# EasyEDA Pro project Keithley 2000 SCAN Panasonic V1.0.epro

# Schematic Keithley 2000 SCAN Panasonic V1.0
Board Name: Keithley 2000 SCAN Panasonic V1.0; Create Date: 2026-03-20; Page Name: Main; Project Name: SCAN2000; Schematic Name: Keithley 2000 SCAN Panasonic V1.0; Update Date: 2026-03-21; Company: EasyEDA.com; Page Size: A4; Version: V1.0
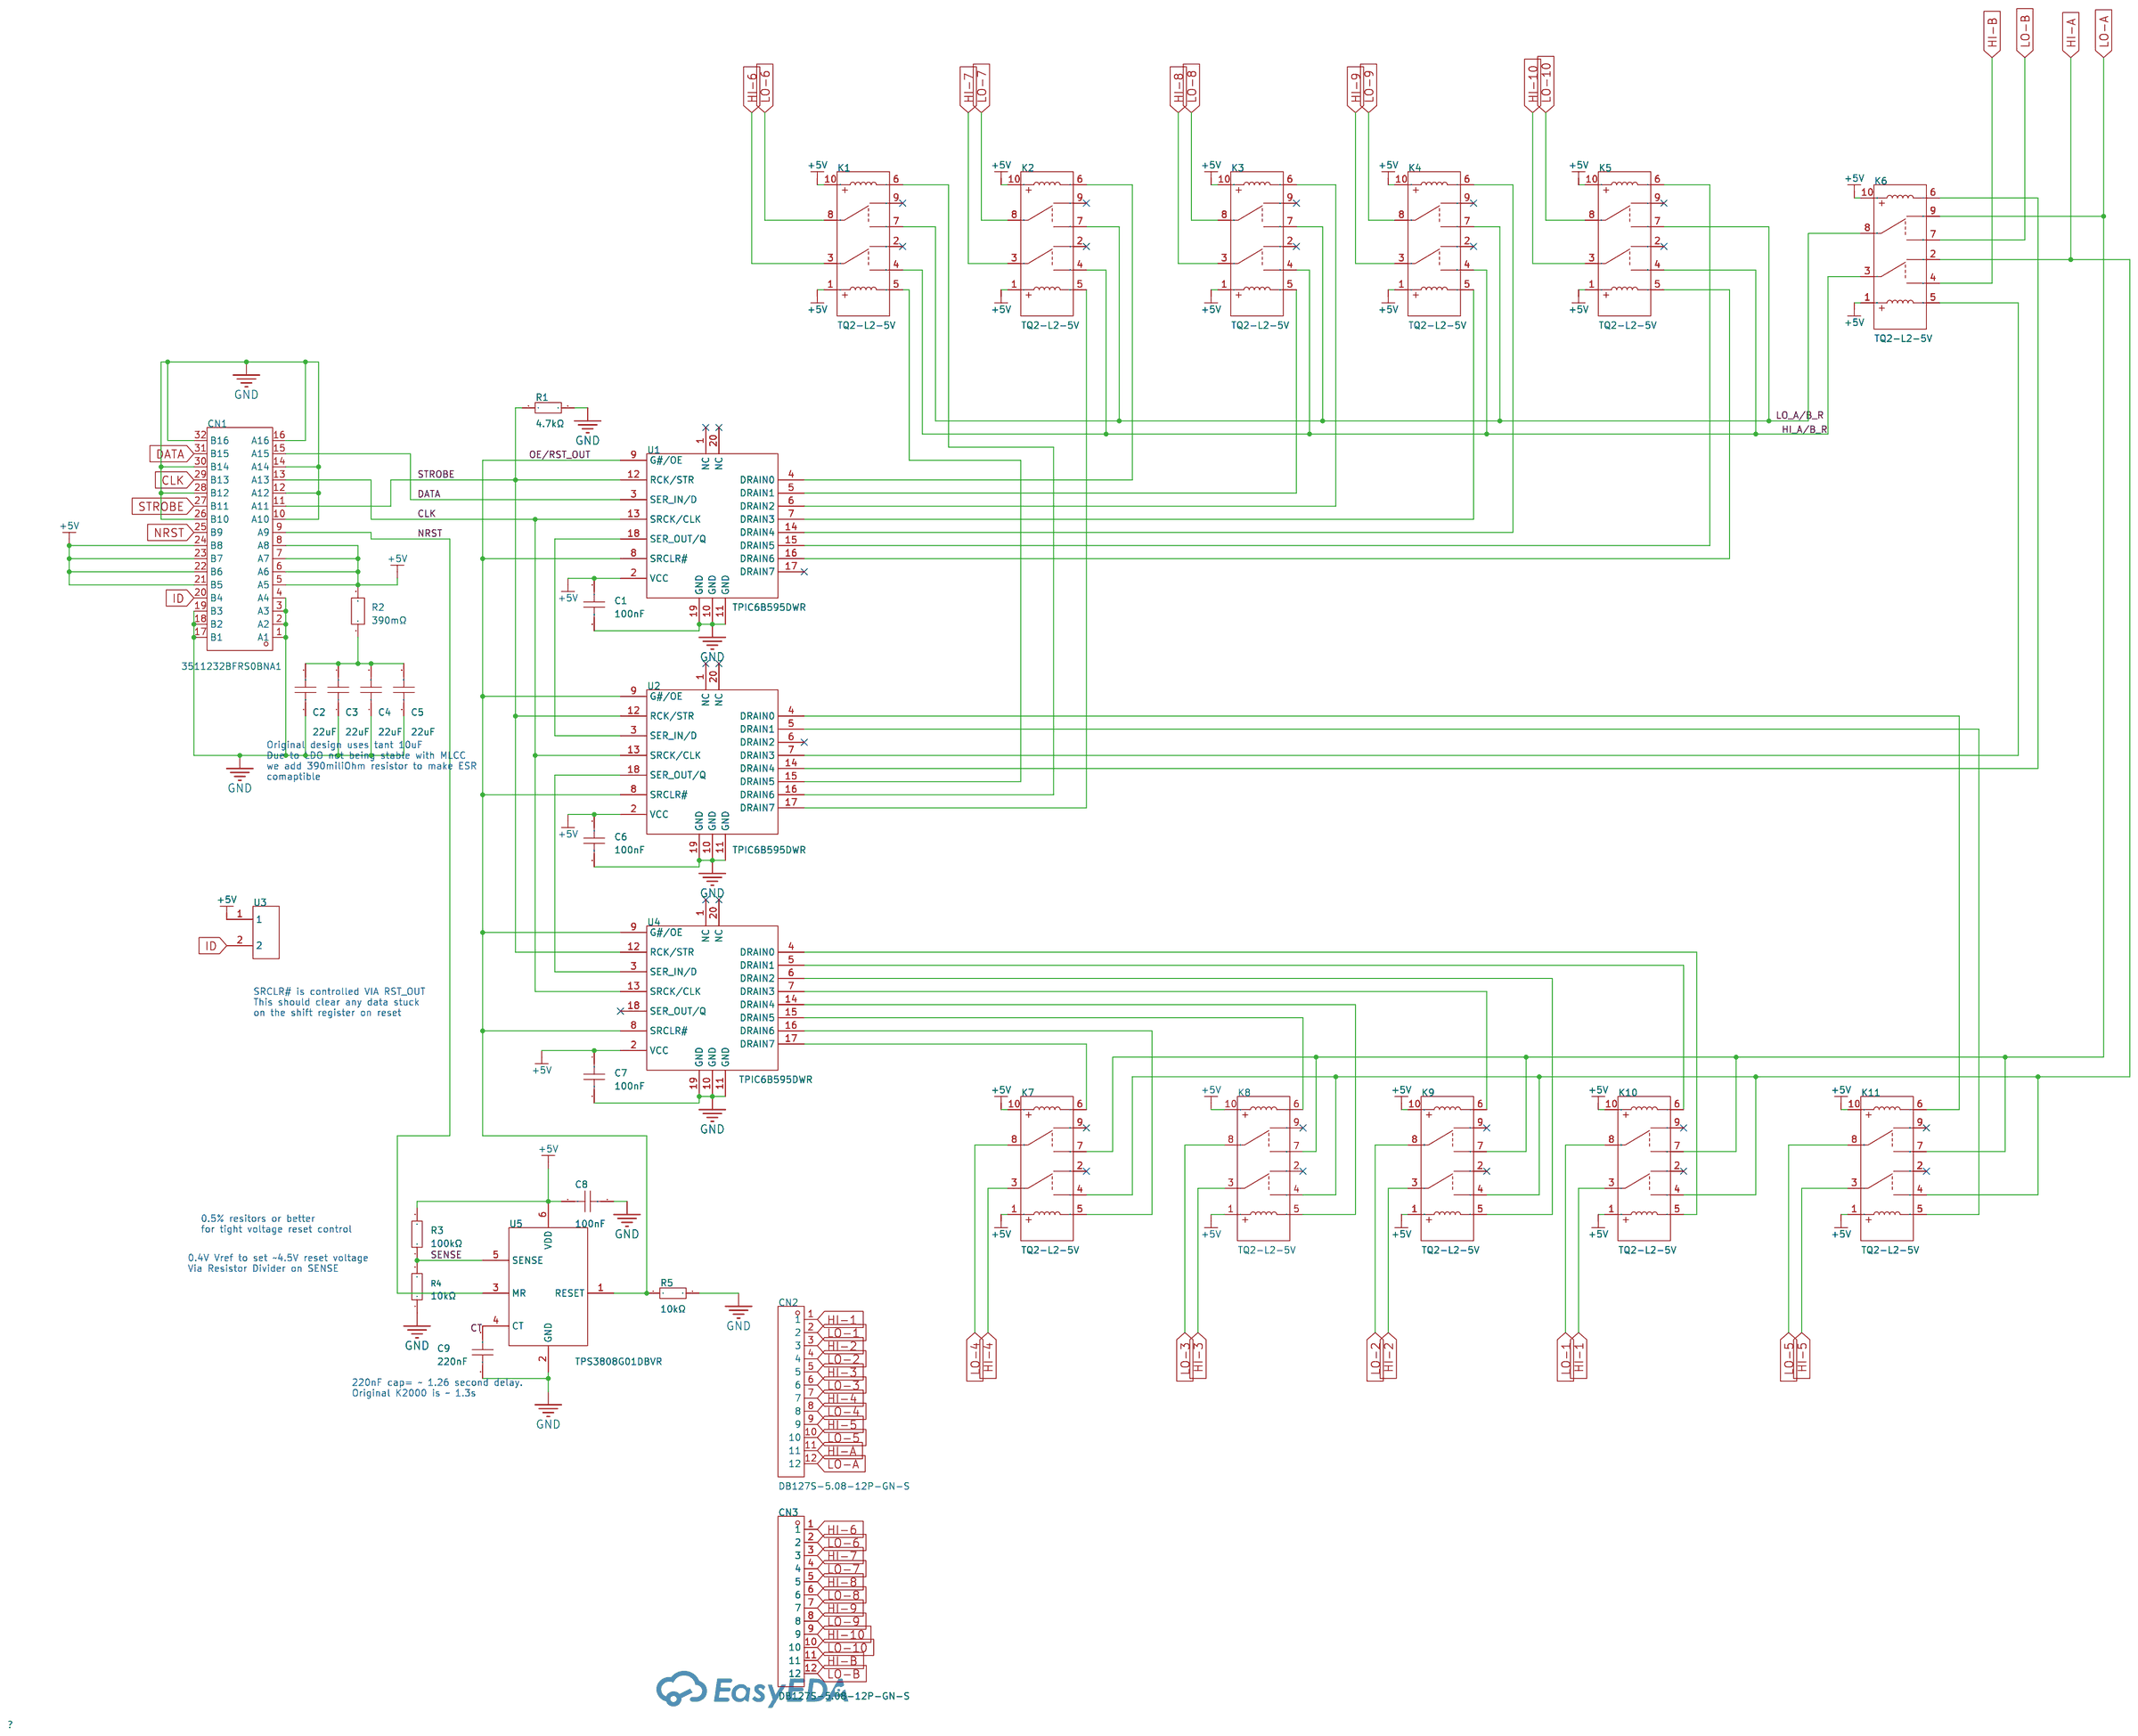
[diagram p0: schematic sheet]

## Parts
C1  100nF  [C0603]
C2  22uF  [C0805]
C3  22uF  [C0805]
C4  22uF  [C0805]
C5  22uF  [C0805]
C6  100nF  [C0603]
C7  100nF  [C0603]
C8  100nF  [C0603]
C9  220nF  [C0603]
CN1  3511232BFRS0BNA1  [CONN-TH_3511232BFRS0BNA1]
CN2  DB127S-5.08-12P-GN-S  [CONN-TH_12P-P5.08_DB127S-5.08-12P-GN-S]
CN3  DB127S-5.08-12P-GN-S  [CONN-TH_12P-P5.08_DB127S-5.08-12P-GN-S]
K1  TQ2-L2-5V  [RELAY-TH_TQ2-L2-XXV]
K2  TQ2-L2-5V  [RELAY-TH_TQ2-L2-XXV]
K3  TQ2-L2-5V  [RELAY-TH_TQ2-L2-XXV]
K4  TQ2-L2-5V  [RELAY-TH_TQ2-L2-XXV]
K5  TQ2-L2-5V  [RELAY-TH_TQ2-L2-XXV]
K6  TQ2-L2-5V  [RELAY-TH_TQ2-L2-XXV]
K7  TQ2-L2-5V  [RELAY-TH_TQ2-L2-XXV]
K8  TQ2-L2-5V  [RELAY-TH_TQ2-L2-XXV]
K9  TQ2-L2-5V  [RELAY-TH_TQ2-L2-XXV]
K10  TQ2-L2-5V  [RELAY-TH_TQ2-L2-XXV]
K11  TQ2-L2-5V  [RELAY-TH_TQ2-L2-XXV]
R1  4.7kΩ  [R0603]
R2  390mΩ  [R1206]
R3  100kΩ  [R0603]
R4  10kΩ  [R0603]
R5  10kΩ  [R0603]
U1  TPIC6B595DWR  [SOIC-20_L13.0-W7.6-P1.27-LS10.3-BL]
U2  TPIC6B595DWR  [SOIC-20_L13.0-W7.6-P1.27-LS10.3-BL]
U3  -  [Solder Jumper New]
U4  TPIC6B595DWR  [SOIC-20_L13.0-W7.6-P1.27-LS10.3-BL]
U5  TPS3808G01DBVR  [SOT-23-6_L2.9-W1.6-P0.95-LS2.8-BR]

## Library data of the parts
C1 C6-C8 = CL10B104KB8NNNC: Capacitance:100nF Tolerance:±10% Tolerance:±10% Voltage Rating:50V Temperature Coefficient:X7R; LCSC Part Name: 100nF ±10% 50V; Supplier Part: C1591; Manufacturer: SAMSUNG(三星); Supplier Footprint: 0603; JLCPCB Part Class: Extended Part; Datasheet: https://item.szlcsc.com/datasheet/CL10B104KB8NNNC/1943.html; Supplier: LCSC; Tolerance: ±10%; Voltage Rating: 50V; Temperature Coefficient: X7R
C2-C5 = CL21A226MAYNNNE: Capacitance:22uF Tolerance:±20% Tolerance:±20% Voltage Rating:25V Temperature Coefficient:X5R; LCSC Part Name: 22uF ±20% 25V; Supplier Part: C602037; Manufacturer: SAMSUNG(三星); Supplier Footprint: 0805; Datasheet: https://item.szlcsc.com/datasheet/CL21A226MAYNNNE/631473.html; Supplier: LCSC; Tolerance: ±20%; Voltage Rating: 25V; Temperature Coefficient: X5R
C9 = CL10B224KA8NNNC: Capacitance:220nF Tolerance:±10% Tolerance:±10% Voltage Rating:25V Temperature Coefficient:X7R; LCSC Part Name: 220nF ±10% 25V; Supplier Part: C21120; Manufacturer: SAMSUNG(三星); Supplier Footprint: 0603; JLCPCB Part Class: Basic Part; Datasheet: https://item.szlcsc.com/datasheet/CL10B224KA8NNNC/21832.html; Supplier: LCSC; Tolerance: ±10%; Voltage Rating: 25V; Temperature Coefficient: X7R
CN1 = 3511232BFRS0BNA1: Number of Pins:32P Pitch:2.54mm Mounting Type:Right Angle Number of Rows:2 Current Rating:3A Contact Material:Brass Contact Plating:Gold Operating Temperature:-40℃~+105℃ Operating Temperature:-40℃~+105℃; LCSC Part Name: PIN:32P 间距:2.54mm 弯插; Supplier Part: C963692; Manufacturer: JILN(锦凌); Supplier Footprint: 弯插,P=2.54mm; Datasheet: https://item.szlcsc.com/datasheet/3511232BFRS0BNA1/1048125.html; Supplier: LCSC; Number of Pins: 32P; Pitch: 2.54mm; Mounting Type: Right Angle; Number of Rows: 2; Current Rating: 3A; Contact Material: Brass; Contact Plating: Gold; Operating Temperature: -40℃~+105℃
CN2 CN3 = DB127S-5.08-12P-GN-S: Number of Positions or Pins:1x12P Pitch:5.08mm Color:Green Mounting Type:Through Hole Number of Pins:12P Number of Rows:1 Number of PINs Per Row:12 Screw Specification:M3 Current Rating:12A Voltage Rating (Max):300V Wire Gauge - AWG:14~26 Wire Gauge - mm2; LCSC Part Name: 1x12P 5.08mm 直插 排数:1 每排P数:12; Supplier Part: C18198311; Manufacturer: DORABO(地博电气); Supplier Footprint: 插件,P=5.08mm; JLCPCB Part Class: Extended Part; Datasheet: https://item.szlcsc.com/datasheet/DB127S-5.08-12P-GN-S/19349685.html; Supplier: LCSC; Number of Positions or Pins: 1x12P; Pitch: 5.08mm; Color: Green; Mounting Type: Through Hole; Number of Pins: 12P; Number of Rows: 1; Number of PINs Per Row: 12; Screw Specification: M3; Current Rating: 12A; Voltage Rating (Max): 300V; Wire Gauge - AWG: 14~26; Wire Gauge - mm2: 1.5; Operating Temperature: -40℃~+105℃
K1-K11 = TQ2-L2-5V: Coil Voltage:5V Contact Form:2 Form C: 2C (DPDT-CO) Number of Pins:- Contact Rating:- Switching Voltage(Max):125V@AC；110V@DC Coil Type:Dual Coil Contact Material:Silver + Gold Plated Coil Rated Power:- Coil Resistance:- Switching Current(Max):1A Operate T; Supplier Part: C1525303; Manufacturer: PANASONIC(松下); Supplier Footprint: DIP,14x9mm; JLCPCB Part Class: Extended Part; Datasheet: https://item.szlcsc.com/datasheet/TQ2-L2-5V/1616102.html; Supplier: LCSC; Coil Voltage: 5V; Contact Form: 2 Form C: 2C (DPDT-CO); Switching Voltage(Max): 125V@AC；110V@DC; Coil Type: Dual Coil; Contact Material: Silver + Gold Plated; Switching Current(Max): 1A; Operate Time: 3ms; Release Time: 3ms; Operating Temperature: -40℃~+70℃
R1 = RC0603FR-074K7L: Type:Thick Film Resistor Resistance:4.7kΩ Tolerance:±1% Tolerance:±1% Power(Watts):100mW Voltage-Supply(Max):75V Temperature Coefficient:±100ppm/℃ Temperature Coefficient:±100ppm/℃ Operating Temperature:-55℃~+155℃ Operating Temperature:-55℃~+155℃; LCSC Part Name: 厚膜电阻 4.7kΩ ±1% 100mW; Supplier Part: C99782; Manufacturer: YAGEO(国巨); Supplier Footprint: 0603; JLCPCB Part Class: Extended Part; Datasheet: https://item.szlcsc.com/datasheet/RC0603FR-074K7L/100996.html; Supplier: LCSC; Type: Thick Film Resistor; Tolerance: ±1%; Power(Watts): 100mW; Voltage-Supply(Max): 75V; Temperature Coefficient: ±100ppm/℃; Operating Temperature: -55℃~+155℃
R2 = FRL1206FR390TS: Type:Thick Film Resistor Resistance:390mΩ Tolerance:±1% Tolerance:±1% Power(Watts):250mW Voltage-Supply(Max):500V Temperature Coefficient:±300ppm/℃ Temperature Coefficient:±300ppm/℃ Operating Temperature:-55℃~+155℃ Operating Temperature:-55℃~+155℃; LCSC Part Name: 390mΩ ±1% 250mW 厚膜电阻; Supplier Part: C2907353; Manufacturer: FOJAN(富捷); Supplier Footprint: 1206; JLCPCB Part Class: Extended Part; Datasheet: https://item.szlcsc.com/datasheet/FRL1206FR390TS/3180866.html; Supplier: LCSC; Type: Thick Film Resistor; Tolerance: ±1%; Power(Watts): 250mW; Voltage-Supply(Max): 500V; Temperature Coefficient: ±300ppm/℃; Operating Temperature: -55℃~+155℃
R3 = AR03DTCX1003: Type:Thin Film Resistor Resistance:100kΩ Tolerance:±0.5% Tolerance:±0.5% Power(Watts):100mW Voltage-Supply(Max):75V Temperature Coefficient:±25ppm/℃ Temperature Coefficient:±25ppm/℃ Operating Temperature:-55℃~+155℃ Operating Temperature:-55℃~+155℃; LCSC Part Name: 薄膜电阻 100kΩ ±0.5% 100mW; Supplier Part: C319967; Manufacturer: Viking(光颉); Supplier Footprint: 0603; Datasheet: https://item.szlcsc.com/datasheet/AR03DTCX1003/301037.html; Supplier: LCSC; Type: Thin Film Resistor; Tolerance: ±0.5%; Power(Watts): 100mW; Voltage-Supply(Max): 75V; Temperature Coefficient: ±25ppm/℃; Operating Temperature: -55℃~+155℃
R4 = 0603WAD1002T5E: Type:Thick Film Resistor Resistance:10kΩ Tolerance:±0.5% Tolerance:±0.5% Power(Watts):100mW Voltage-Supply(Max):75V Temperature Coefficient:±100ppm/℃ Temperature Coefficient:±100ppm/℃ Operating Temperature:-55℃~+155℃ Operating Temperature:-55℃~+155℃; LCSC Part Name: 10kΩ ±0.5% 100mW 厚膜电阻; Supplier Part: C167144; Manufacturer: UNI-ROYAL(厚声); Supplier Footprint: 0603; JLCPCB Part Class: Extended Part; Datasheet: https://item.szlcsc.com/datasheet/0603WAD1002T5E/178527.html; Supplier: LCSC; Type: Thick Film Resistor; Tolerance: ±0.5%; Power(Watts): 100mW; Voltage-Supply(Max): 75V; Temperature Coefficient: ±100ppm/℃; Operating Temperature: -55℃~+155℃
R5 = RC0603FR-0710KL: Type:Thick Film Resistors Resistance: Tolerance:±1% Tolerance:±1% Power(Watts): Overload Voltage (Max): Temperature Coefficient:±100ppm/℃ Temperature Coefficient:±100ppm/℃ Operating Temperature Range:-55℃~+155℃ Operating Temperature Range:-55℃~+155℃; LCSC Part Name: 厚膜电阻 10kΩ ±1% 100mW; Supplier Part: C98220; Manufacturer: YAGEO(国巨); Supplier Footprint: 0603; JLCPCB Part Class: Extended Part; Datasheet: https://atta.szlcsc.com/upload/public/pdf/source/20180927/C295883_E8D83085EA81BD7DE0B2B681138C15EE.pdf; Supplier: LCSC; Type: Thick Film Resistors; Tolerance: ±1%; Temperature Coefficient: ±100ppm/℃; Operating Temperature Range: -55℃~+155℃
U1 U2 U4 = TPIC6B595DWR: Function:Serial-to-Serial or Parallel Voltage - Supply:4.5V~5.5V Voltage - Supply:4.5V~5.5V Clock Frequency:- Number of Elements:1 Number of Bits per Element:- Output Type:Open Drain Series:TPIC Operating Temperature:-40℃~+125℃ Operating Temperature:-40℃~; LCSC Part Name: 开路漏极输出 8位串行至串行或并行移位寄存器; Supplier Part: C7094; Manufacturer: TI(德州仪器); Supplier Footprint: SOIC-20-300mil; JLCPCB Part Class: Extended Part; Datasheet: https://www.ti.com/cn/lit/gpn/tpic6b595; Supplier: LCSC; Function: Serial-to-Serial or Parallel; Voltage - Supply: 4.5V~5.5V; Number of Elements: 1; Output Type: Open Drain; Series: TPIC; Operating Temperature: -40℃~+125℃
U3 = Solder Jumper New
U5 = TPS3808G01DBVR: ChipType:Voltage monitor Output Type:Open Drain Voltage - Supply:1.7V~6.5V Voltage - Supply:1.7V~6.5V Reset Active Level:Active Low Threshold Voltage:405mV Number of Voltages Monitored:1 Manual Reset:Yes Watchdog:No Reset Timeout:20us Operating Temperatur; LCSC Part Name: 低静态电流可编程延迟监控电路; Supplier Part: C19653; Manufacturer: TI(德州仪器); Supplier Footprint: SOT-23-6; JLCPCB Part Class: Extended Part; Datasheet: https://www.ti.com/cn/lit/gpn/tps3808; Supplier: LCSC; ChipType: Voltage monitor; Output Type: Open Drain; Voltage - Supply: 1.7V~6.5V; Reset Active Level: Active Low; Threshold Voltage: 405mV; Number of Voltages Monitored: 1; Manual Reset: Yes; Watchdog: No; Reset Timeout: 20us; Operating Temperature: -40℃~+125℃@(Tj)

## Nets
+5V: C1.1 C6.1 C7.1 C8.2 CN1.5(A5) CN1.6(A6) CN1.7(A7) CN1.8(A8) CN1.21(B5) CN1.22(B6) CN1.23(B7) CN1.24(B8) K1.1 K1.10(6) K2.1 K2.10(6) K3.1 K3.10(6) K4.1 K4.10(6) K5.1 K5.10(6) K6.1 K6.10(6) K7.1 K7.10(6) K8.1 K8.10(6) K9.1 K9.10(6) K10.1 K10.10(6) K11.1 K11.10(6) R2.2 R3.2 U1.2(VCC) U2.2(VCC) U3.1 U4.2(VCC) U5.6(VDD)
GND: C1.2 C2.1 C3.1 C4.1 C5.1 C6.2 C7.2 C8.1 C9.2 CN1.1(A1) CN1.2(A2) CN1.3(A3) CN1.4(A4) CN1.10(A10) CN1.12(A12) CN1.14(A14) CN1.16(A16) CN1.17(B1) CN1.18(B2) CN1.19(B3) CN1.26(B10) CN1.28(B12) CN1.30(B14) CN1.32(B16) R1.2 R4.1 R5.2 U1.10(GND) U1.11(GND) U1.19(GND) U2.10(GND) U2.11(GND) U2.19(GND) U4.10(GND) U4.11(GND) U4.19(GND) U5.2(GND)
CLK: CN1.13(A13) CN1.29(B13) U1.13(SRCK/CLK) U2.13(SRCK/CLK) U4.13(SRCK/CLK)
CT: C9.1 U5.4(CT)
DATA: CN1.15(A15) CN1.31(B15) U1.3(SER IN/D)
HI-1: CN2.1 K10.3(4)
HI-2: CN2.3 K9.3(4)
HI-3: CN2.5 K8.3(4)
HI-4: CN2.7 K7.3(4)
HI-5: CN2.9 K11.3(4)
HI-6: CN3.1 K1.3(4)
HI-7: CN3.3 K2.3(4)
HI-8: CN3.5 K3.3(4)
HI-9: CN3.7 K4.3(4)
HI-10: CN3.9 K5.3(4)
HI-A: CN2.11 K6.2(3) K7.4(5) K8.4(5) K9.4(5) K10.4(5) K11.4(5)
HI-B: CN3.11 K6.4(5)
HI_A/B_R: K1.4(5) K2.4(5) K3.4(5) K4.4(5) K5.4(5) K6.3(4)
ID: CN1.20(B4) U3.2
LO-1: CN2.2 K10.8(9)
LO-2: CN2.4 K9.8(9)
LO-3: CN2.6 K8.8(9)
LO-4: CN2.8 K7.8(9)
LO-5: CN2.10 K11.8(9)
LO-6: CN3.2 K1.8(9)
LO-7: CN3.4 K2.8(9)
LO-8: CN3.6 K3.8(9)
LO-9: CN3.8 K4.8(9)
LO-10: CN3.10 K5.8(9)
LO-A: CN2.12 K6.9(10) K7.7(8) K8.7(8) K9.7(8) K10.7(8) K11.7(8)
LO-B: CN3.12 K6.7(8)
LO_A/B_R: K1.7(8) K2.7(8) K3.7(8) K4.7(8) K5.7(8) K6.8(9)
NRST: CN1.9(A9) CN1.25(B9) U5.3(MR)
OE/RST_OUT: R5.1 U1.8(SRCLR#) U1.9(G#/OE) U2.8(SRCLR#) U2.9(G#/OE) U4.8(SRCLR#) U4.9(G#/OE) U5.1(RESET)
SENSE: R3.1 R4.2 U5.5(SENSE)
STROBE: CN1.11(A11) CN1.27(B11) R1.1 U1.12(RCK/STR) U2.12(RCK/STR) U4.12(RCK/STR)
$K1_5: K1.5(12) U2.15(DRAIN5)
$K1_6: K1.6(7) U2.16(DRAIN6)
$K2_5: K2.5(12) U2.17(DRAIN7)
$K2_6: K2.6(7) U1.4(DRAIN0)
$K3_5: K3.5(12) U1.5(DRAIN1)
$K3_6: K3.6(7) U1.6(DRAIN2)
$K4_5: K4.5(12) U1.7(DRAIN3)
$K4_6: K4.6(7) U1.14(DRAIN4)
$K5_5: K5.5(12) U1.16(DRAIN6)
$K5_6: K5.6(7) U1.15(DRAIN5)
$K6_5: K6.5(12) U2.7(DRAIN3)
$K6_6: K6.6(7) U2.14(DRAIN4)
$K11_5: K11.5(12) U2.5(DRAIN1)
$K11_6: K11.6(7) U2.4(DRAIN0)
$U1_18: U1.18(SER OUT/Q) U2.3(SER IN/D)
Net-(C2-2): C2.2 C3.2 C4.2 C5.2 R2.1
Net-(K7-5): K7.5(12) U4.16(DRAIN6)
Net-(K7-6): K7.6(7) U4.17(DRAIN7)
Net-(K8-5): K8.5(12) U4.14(DRAIN4)
Net-(K8-6): K8.6(7) U4.15(DRAIN5)
Net-(K9-5): K9.5(12) U4.6(DRAIN2)
Net-(K9-6): K9.6(7) U4.7(DRAIN3)
Net-(K10-5): K10.5(12) U4.4(DRAIN0)
Net-(K10-6): K10.6(7) U4.5(DRAIN1)
Net-(U2-18): U2.18(SER OUT/Q) U4.3(SER IN/D)

Not connected (* = marked no-connect by the designer): K1 2(3)* 9(10)*; K2 2(3)* 9(10)*; K3 2(3)* 9(10)*; K4 2(3)* 9(10)*; K5 2(3)* 9(10)*; K7 2(3)* 9(10)*; K8 2(3)* 9(10)*; K9 2(3)* 9(10)*; K10 2(3)* 9(10)*; K11 2(3)* 9(10)*; U1 1(NC)* 17(DRAIN7)* 20(NC)*; U2 1(NC)* 6(DRAIN2)* 20(NC)*; U4 1(NC)* 18(SER OUT/Q)* 20(NC)*

## Notes on the sheet
- Original design uses tant 10uF
  Due to LDO not being stable with MLCC
  we add 390miliOhm resistor to make ESR
  comaptible
- SRCLR# is controlled VIA RST_OUT
  This should clear any data stuck
  on the shift register on reset
- 0.5% resitors or better
  for tight voltage reset control
- 0.4V Vref to set ~4.5V reset voltage
  Via Resistor Divider on SENSE
- 220nF cap= ~ 1.26 second delay.
  Original K2000 is ~ 1.3s

# Board Keithley 2000 SCAN Panasonic V1.0
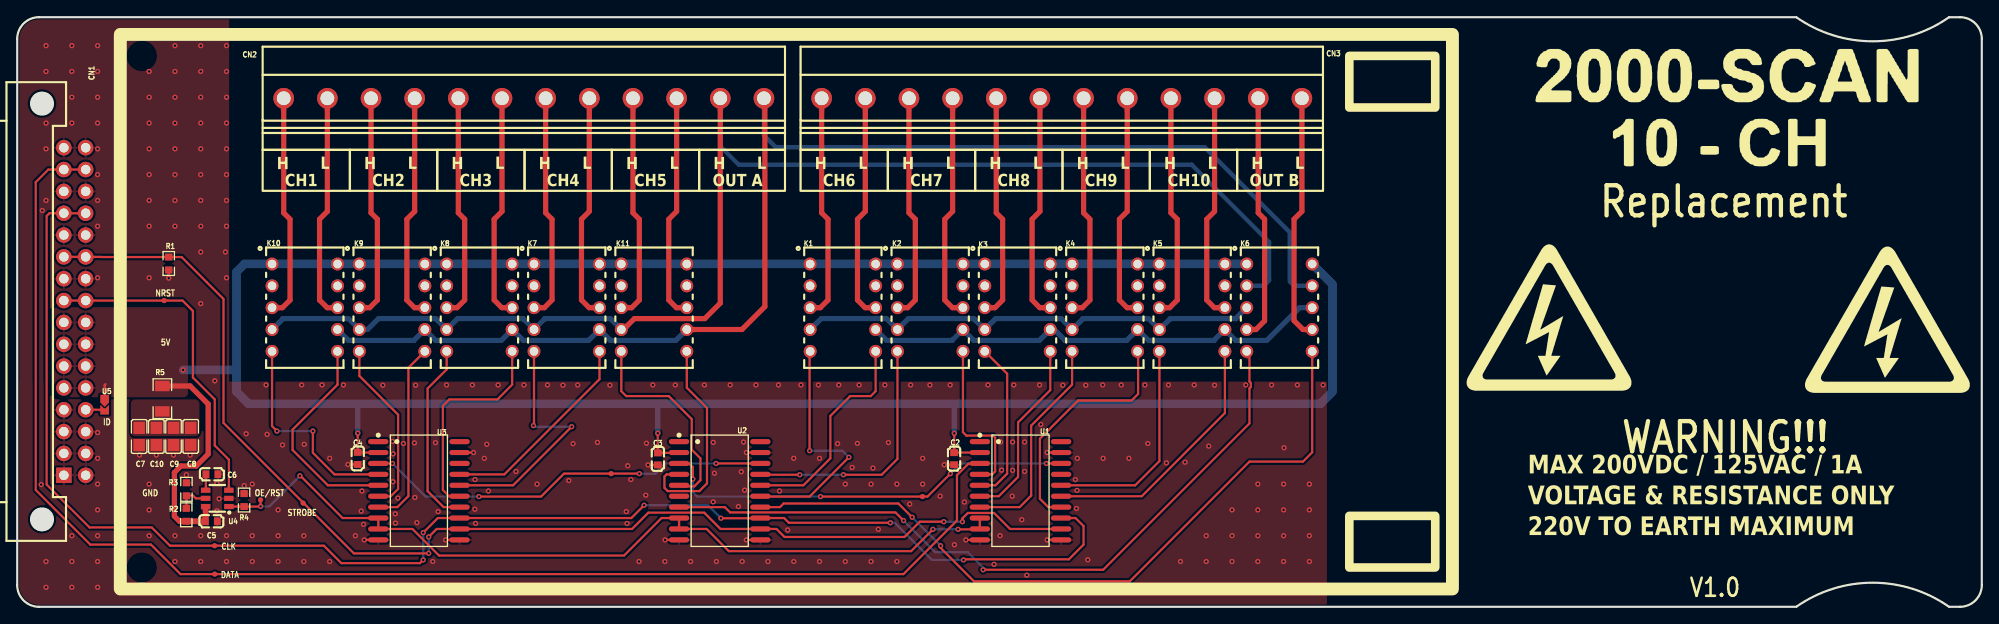
[diagram p1: board, top side]
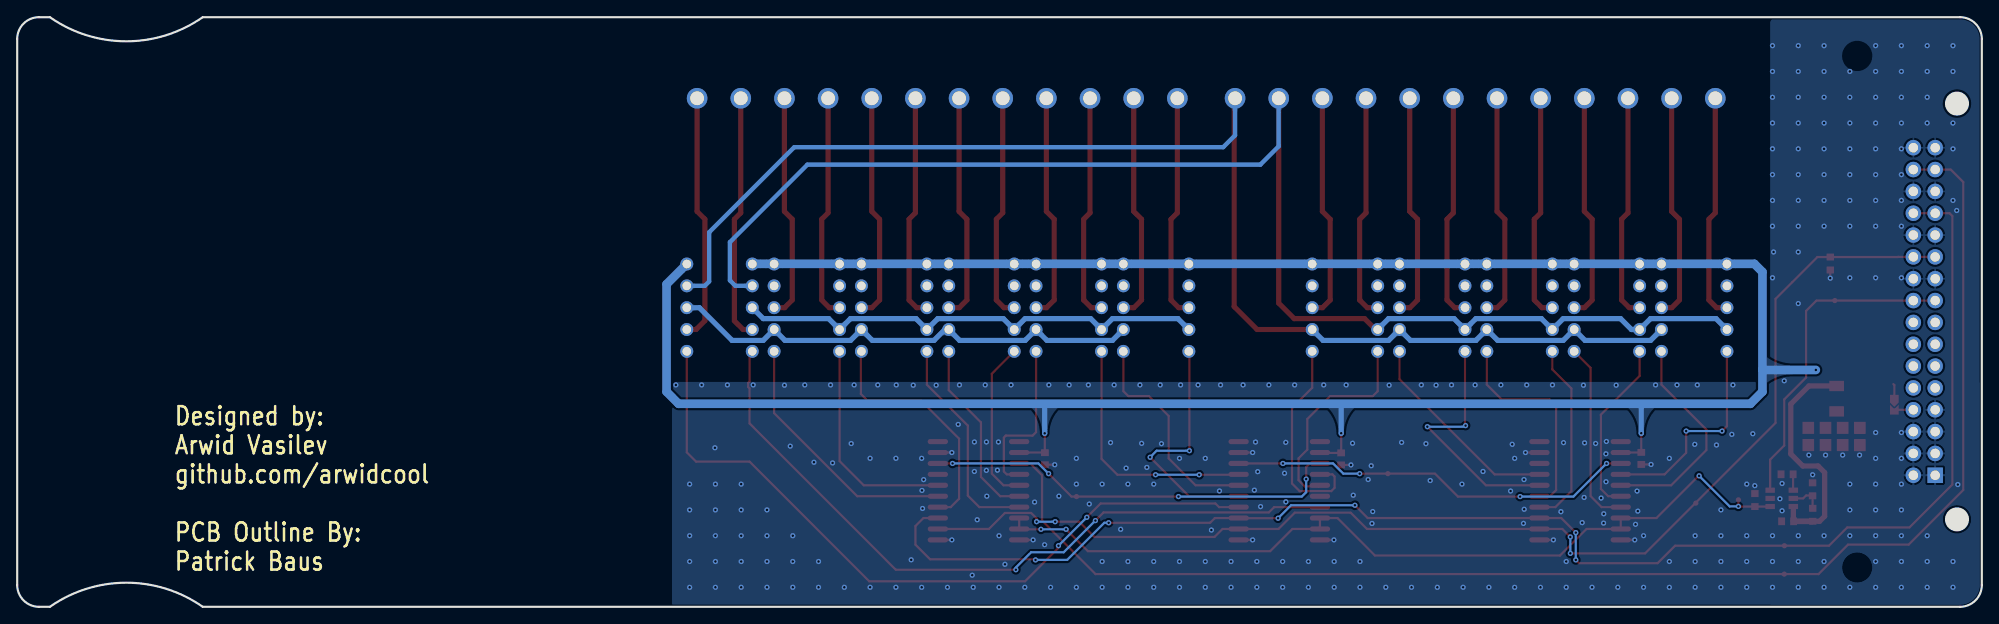
[diagram p2: board, bottom side, seen from below]

Outline 228.6 x 68.58 mm; copper layers: Top Layer, Bottom Layer. Coordinates in mm from the lower left corner of the outline.
Outline path: 0,66.04 arc(0.74,67.84) 2.54,68.58 207.01,68.58 arc(215.9,65.78) 224.79,68.58 226.06,68.58 arc(227.86,67.84) 228.6,66.04 228.6,2.54 arc(227.86,0.74) 226.06,0 224.79,0 arc(215.9,2.8) 207.01,0 2.54,0 arc(0.74,0.74) 0,2.54 0,66.04
Stack: Top Layer 0.035mm / Dielectric1 1.51mm FR4 er 4.5 / Bottom Layer 0.035mm

## Design rules (mm)
template: JLCPCB Capability(Two Layers Board)
spacing copperThickness1oz (default): track to track 0.102, other pairs 0.152 to 0.3
spacing copperThickness2oz: track to track 0.203, other pairs 0.152 to 0.3
track width copperThickness1oz (default): min 0.127, default 0.254, max 2.54
track width copperThickness2oz: min 0.203, default 0.254, max 2.54
differential pair differentialPair (default): width min 0.127, default 0.254, max 2.54; gap min 0.152, default 0.152
via viaSize (default): diameter min 0.5, default 0.61, max 10; hole min 0.3, default 0.305, max 6.3

## Placement (name value [footprint] x y rotation side)
C2  22uF  [C0603]  109.02 17.23 270 top
C3  22uF  [C0603]  74.55 17.2 270 top
C4  22uF  [C0603]  39.62 17.26 270 top
C5  22uF  [C0603]  22.6 9.95 180 top
C6  100nF  [C0603]  22.66 15.42 0 top
C7  100nF  [C0805]  14.19 19.81 90 top
C8  100nF  [C0805]  20.19 19.81 90 top
C9  220nF  [C0805]  18.19 19.81 90 top
C10  22uF  [C0805]  16.19 19.81 90 top
CN1  3511232BFRS0BNA1  [CONN-TH_3511232BFRS0BNA1]  6.7 34.35 270 top
CN2  DB127S-5.08-12P-GN-S  [CONN-TH_12P-P5.08_DB127S-5.08-12P-GN-S]  58.95 59.15 0 top
CN3  DB127S-5.08-12P-GN-S  [CONN-TH_12P-P5.08_DB127S-5.08-12P-GN-S]  121.55 59.15 0 top
K1  TQ2-L2-5V  [RELAY-TH_TQ2-L2-XXV]  96.08 34.79 270 top
K2  TQ2-L2-5V  [RELAY-TH_TQ2-L2-XXV]  106.24 34.79 270 top
K3  TQ2-L2-5V  [RELAY-TH_TQ2-L2-XXV]  116.4 34.79 270 top
K4  TQ2-L2-5V  [RELAY-TH_TQ2-L2-XXV]  126.56 34.79 270 top
K5  TQ2-L2-5V  [RELAY-TH_TQ2-L2-XXV]  136.72 34.79 270 top
K6  TQ2-L2-5V  [RELAY-TH_TQ2-L2-XXV]  146.88 34.79 270 top
K7  TQ2-L2-5V  [RELAY-TH_TQ2-L2-XXV]  63.95 34.79 270 top
K8  TQ2-L2-5V  [RELAY-TH_TQ2-L2-XXV]  53.79 34.79 270 top
K9  TQ2-L2-5V  [RELAY-TH_TQ2-L2-XXV]  43.63 34.79 270 top
K10  TQ2-L2-5V  [RELAY-TH_TQ2-L2-XXV]  33.47 34.79 270 top
K11  TQ2-L2-5V  [RELAY-TH_TQ2-L2-XXV]  74.11 34.79 270 top
NOREF  -  [Pad_e19999]  28.32 12.44 0 top
NOREF#2  -  [Pad_e19981]  17.1 35.62 0 top
NOREF#3  -  [Pad_e20018]  69.11 15.49 0 top
NOREF#4  -  [Pad_e19987]  33.28 12.06 0 top
NOREF#5  -  [Pad_e20005]  22.99 3.8 0 top
NOREF#6  -  [Pad_e2097]  22.97 7.11 0 top
NOREF#7  -  [Pad_e20012]  105.34 12.82 0 top
R1  4.7kΩ  [R0603]  17.63 39.93 270 top
R2  390mΩ  [R0603]  19.67 10.7 270 top
R3  100kΩ  [R0603]  19.69 13.67 270 top
R4  10kΩ  [R0603]  26.4 12.42 90 top
R5  10kΩ  [R1206]  16.89 24.21 90 top
U1  TPIC6B595DWR  [SOIC-20_L13.0-W7.6-P1.27-LS10.3-BL]  116.74 13.5 270 top
U2  TPIC6B595DWR  [SOIC-20_L13.0-W7.6-P1.27-LS10.3-BL]  81.74 13.5 270 top
U3  TPIC6B595DWR  [SOIC-20_L13.0-W7.6-P1.27-LS10.3-BL]  46.74 13.5 270 top
U4  TPIC6B595DWR  [SOT-23-6_L2.9-W1.6-P0.95-LS2.8-BR]  23.28 12.61 0 top
U5  TPS3808G01DBVR  [Solder Jumper New]  10.18 23.25 270 top

## Footprints (pads in the part's own frame, mm; a bottom-side part is the same pattern mirrored in y, then rotated)
C0603
  rect 0.8x0.9 smd: 1(-0.7,0) 2(0.7,0)
C0805
  rect 1.41x1.35 smd: 1(-1,0) 2(1,0)
CONN-TH_12P-P5.08_DB127S-5.08-12P-GN-S
  round 2.4 hole 1.6: 1(-27.94,0) 2(-22.86,0) 3(-17.78,0) 4(-12.7,0) 5(-7.62,0) 6(-2.54,0) 7(2.54,0) 8(7.62,0) 9(12.7,0) 10(17.78,0) 11(22.86,0) 12(27.94,0)
CONN-TH_3511232BFRS0BNA1
  rect 1.8x1.8 hole 1.1: 1(19.05,-1.27)
  round 1.8 hole 1.1: 2(16.51,-1.27) 3(13.97,-1.27) 4(11.43,-1.27) 5(8.89,-1.27) 6(6.35,-1.27) 7(3.81,-1.27) 8(1.27,-1.27) 9(-1.27,-1.27) 10(-3.81,-1.27) 11(-6.35,-1.27) 12(-8.89,-1.27) 13(-11.43,-1.27) 14(-13.97,-1.27) 15(-16.51,-1.27) 16(-19.05,-1.27) 17(19.05,1.27) 18(16.51,1.27) 19(13.97,1.27) 20(11.43,1.27) 21(8.89,1.27) 22(6.35,1.27) 23(3.81,1.27) 24(1.27,1.27) 25(-1.27,1.27) 26(-3.81,1.27) 27(-6.35,1.27) 28(-8.89,1.27) 29(-11.43,1.27) 30(-13.97,1.27) 31(-16.51,1.27) 32(-19.05,1.27)
Pad_e2097
  round 0.61 smd: TP1(0,0)
Pad_e19981
  round 0.61 smd: TP1(0,0)
Pad_e19987
  round 0.61 smd: TP2(0,0)
Pad_e19999
  round 0.61 smd: TP4(0,0)
Pad_e20005
  round 0.61 smd: TP5(0,0)
Pad_e20012
  round 0.61 smd: TP6(0,0)
Pad_e20018
  round 0.61 smd: TP7(0,0)
R0603
  rect 0.806x0.864 smd: 1(-0.753,0) 2(0.753,0)
R1206
  rect 1.208x1.701 smd: 1(-1.479,0) 2(1.479,0)
RELAY-TH_TQ2-L2-XXV
  round 1.5 hole 1: 1(-5.08,-3.81) 2(-2.54,-3.81) 3(0,-3.81) 4(2.54,-3.81) 5(5.08,-3.81) 6(5.08,3.81) 7(2.54,3.81) 8(0,3.81) 9(-2.54,3.81) 10(-5.08,3.81)
SOIC-20_L13.0-W7.6-P1.27-LS10.3-BL
  oval 0.595x2.36 smd: 1(-5.715,-4.73) 2(-4.445,-4.73) 3(-3.175,-4.73) 4(-1.905,-4.73) 5(-0.635,-4.73) 6(0.635,-4.73) 7(1.905,-4.73) 8(3.175,-4.73) 9(4.445,-4.73) 10(5.715,-4.73) 11(5.715,4.73) 12(4.445,4.73) 13(3.175,4.73) 14(1.905,4.73) 15(0.635,4.73) 16(-0.635,4.73) 17(-1.905,4.73) 18(-3.175,4.73) 19(-4.445,4.73) 20(-5.715,4.73)
Solder Jumper New
  custom 1.397x1.016 smd: 1(-0.699,0)
  custom 1.143x1.016 smd: 2(0.318,0)
SOT-23-6_L2.9-W1.6-P0.95-LS2.8-BR
  rect 1.1x0.6 smd: 1(1.35,-0.95) 2(1.35,0) 3(1.35,0.95) 4(-1.35,0.95) 5(-1.35,0) 6(-1.35,-0.95)

## Nets
+5V: C2.1 C3.1 C4.1 C5.2 CN1.5 CN1.6 CN1.7 CN1.8 CN1.21 CN1.22 CN1.23 CN1.24 K1.1 K1.10 K2.1 K2.10 K3.1 K3.10 K4.1 K4.10 K5.1 K5.10 K6.1 K6.10 K7.1 K7.10 K8.1 K8.10 K9.1 K9.10 K10.1 K10.10 K11.1 K11.10 R2.2 R5.2 U1.2 U2.2 U3.2 U4.6 U5.1
GND: C2.2 C3.2 C4.2 C5.1 C6.2 C7.1 C8.1 C9.1 C10.1 CN1.1 CN1.2 CN1.3 CN1.4 CN1.10 CN1.12 CN1.14 CN1.16 CN1.17 CN1.18 CN1.19 CN1.26 CN1.28 CN1.30 CN1.32 R1.2 R3.1 R4.2 U1.10 U1.11 U1.19 U2.10 U2.11 U2.19 U3.10 U3.11 U3.19 U4.2
$C10_2: C7.2 C8.2 C9.2 C10.2 R5.1
$K1_5: K1.5 U2.15
$K1_6: K1.6 U2.16
$K2_5: K2.5 U2.17
$K2_6: K2.6 U1.4
$K3_5: K3.5 U1.5
$K3_6: K3.6 U1.6
$K4_5: K4.5 U1.7
$K4_6: K4.6 U1.14
$K5_5: K5.5 U1.16
$K5_6: K5.6 U1.15
$K6_5: K6.5 U2.7
$K6_6: K6.6 U2.14
$K7_5: K7.5 U3.16
$K7_6: K7.6 U3.17
$K8_5: K8.5 U3.14
$K8_6: K8.6 U3.15
$K9_5: K9.5 U3.6
$K9_6: K9.6 U3.7
$K10_5: K10.5 U3.4
$K10_6: K10.6 U3.5
$K11_5: K11.5 U2.5
$K11_6: K11.6 U2.4
$U1_18: NOREF#7.TP6 U1.18 U2.3
$U2_18: NOREF#3.TP7 U2.18 U3.3
CLK: CN1.13 CN1.29 NOREF#6.TP1 U1.13 U2.13 U3.13
CT: C6.1 U4.4
DATA: CN1.15 CN1.31 NOREF#5.TP5 U1.3
HI-1: CN2.1 K10.3
HI-2: CN2.3 K9.3
HI-3: CN2.5 K8.3
HI-4: CN2.7 K7.3
HI-5: CN2.9 K11.3
HI-6: CN3.1 K1.3
HI-7: CN3.3 K2.3
HI-8: CN3.5 K3.3
HI-9: CN3.7 K4.3
HI-10: CN3.9 K5.3
HI-A: CN2.11 K6.2 K7.4 K8.4 K9.4 K10.4 K11.4
HI-B: CN3.11 K6.4
HI_A/B_R: K1.4 K2.4 K3.4 K4.4 K5.4 K6.3
ID: CN1.20 U5.2
LO-1: CN2.2 K10.8
LO-2: CN2.4 K9.8
LO-3: CN2.6 K8.8
LO-4: CN2.8 K7.8
LO-5: CN2.10 K11.8
LO-6: CN3.2 K1.8
LO-7: CN3.4 K2.8
LO-8: CN3.6 K3.8
LO-9: CN3.8 K4.8
LO-10: CN3.10 K5.8
LO-A: CN2.12 K6.9 K7.7 K8.7 K9.7 K10.7 K11.7
LO-B: CN3.12 K6.7
LO_A/B_R: K1.7 K2.7 K3.7 K4.7 K5.7 K6.8
NRST: CN1.9 CN1.25 NOREF#2.TP1 U4.3
OE/RST_OUT: NOREF.TP4 R4.1 U1.8 U1.9 U2.8 U2.9 U3.8 U3.9 U4.1
SENSE: R2.1 R3.2 U4.5
STROBE: CN1.11 CN1.27 NOREF#4.TP2 R1.1 U1.12 U2.12 U3.12

Pads without a net: K1 2 9; K2 2 9; K3 2 9; K4 2 9; K5 2 9; K7 2 9; K8 2 9; K9 2 9; K10 2 9; K11 2 9; U1 1 17 20; U2 1 6 20; U3 1 18 20

## Via types
v1: diameter 0.61, hole 0.305, Top Layer to Bottom Layer, 370 vias

## Routing (per net, layer and track width the routed paths; a pad name or vN(x,y) marks a point on that pad's centre or on a via; arc(x,y) is an arc through that point)
+5V: length 337.1
  Top Layer w0.254: C2.1 109.03,17.94 ; 109.03,17.94 U1.2 ; 109.03,17.94 109.03,20.17 v1(109.04,20.18) ; U5.1 10.18,25.79 10.29,25.9 ; v1(39.62,20.19) 39.62,17.9 39.67,17.94 U3.2 ; U2.2 76.97,17.9 C3.1 74.54,17.91 v1(74.54,20.19)
  Top Layer w0.61: U4.6 21.93,9.98 C5.2 ; 16.89,25.69 20.12,25.69 22.23,23.58 22.23,17.77 20.83,16.38 19.05,16.38 18.29,15.62 18.29,10.54 18.87,9.95 R2.2
  Top Layer w0.66: R2.2 19.68,9.95 C5.2
  Bottom Layer w0.61: v1(74.54,20.19) 74.54,23.59 ; 108.93,23.59 109.04,23.48 v1(109.04,20.18) ; v1(39.62,20.19) 39.62,23.59
  Bottom Layer w1: 37.29,39.89 K10.10 ; 37.29,39.89 39.83,39.89 ; 37.29,39.89 29.67,39.89 ; K6.1 143.05,39.89 39.83,39.89 ; 25.53,27.57 25.53,25.01 26.93,23.62 151.64,23.62 153.04,25.01 153.04,37.52 K6.10 ; 25.53,27.57 25.53,38.95 26.46,39.89 29.66,39.89 ; 25.53,27.57 25.51,27.55 v1(19.31,27.55) ; 39.83,39.89 K9.1
GND: length 19
  Top Layer w0.254: C4.2 v1(38.48,16.56) ; U1.19 v1(119.85,17.94) ; U2.19 v1(84.85,17.94) ; U1.10 v1(110.39,7.78) ; R1.2 v1(17.63,38.22) ; U1.11 v1(119.85,7.78) ; C2.2 v1(107.87,16.53) ; 74.55,16.5 v1(73.41,16.5) ; U3.19 v1(53.1,17.94) ; U3.10 v1(40.39,7.78) ; U2.11 v1(84.85,7.78) ; U2.10 v1(75.39,7.78) ; U3.11 v1(49.85,7.78)
  vias: v1(2.79,14.22) v1(2.92,46.1) v1(3.36,65.27) v1(3.36,62.27) v1(3.36,56.27) v1(3.36,53.27) v1(3.36,47.27) v1(3.36,5.27) v1(3.36,2.27) v1(6.36,65.27) v1(6.36,62.27) v1(6.36,59.27) v1(6.36,56.27) v1(6.36,8.27) v1(6.36,5.27) v1(6.36,2.27) v1(9.36,65.27) v1(9.36,62.27) v1(9.36,59.27) v1(9.36,56.27) v1(9.36,53.27) v1(9.36,50.27) v1(9.36,47.27) v1(9.36,44.27) v1(9.36,38.27) v1(9.36,20.27) v1(9.36,17.27) v1(9.36,14.27) v1(9.36,11.27) v1(9.36,8.27) v1(9.36,5.27) v1(9.36,2.27) v1(12.36,65.27) v1(12.36,62.27) v1(12.36,59.27) v1(12.36,56.27) v1(12.36,53.27) v1(12.36,50.27) v1(12.36,47.27) v1(12.36,44.27) v1(12.36,38.27) v1(12.36,20.27) v1(12.36,17.27) v1(12.36,14.27) v1(12.36,11.27) v1(12.36,8.27) v1(12.36,5.27) v1(12.36,2.27) v1(14.22,17.65) v1(15.36,62.27) v1(15.36,59.27) v1(15.36,56.27) v1(15.36,53.27) v1(15.36,50.27) v1(15.36,47.27) v1(15.36,44.27) v1(15.36,38.27) v1(15.36,14.27) v1(15.36,11.27) v1(15.36,8.27) v1(15.36,2.27) v1(16.19,17.65) v1(18.18,17.65) v1(18.36,65.27) v1(18.36,62.27) v1(18.36,59.27) v1(18.36,56.27) v1(18.36,53.27) v1(18.36,50.27) v1(18.36,47.27) v1(18.36,44.27) v1(18.36,8.27) v1(18.36,5.27) v1(18.36,2.27) v1(19.69,15.36) v1(20.13,17.65) v1(21.36,65.27) v1(21.36,62.27) v1(21.36,59.27) v1(21.36,56.27) v1(21.36,53.27) v1(21.36,50.27) v1(21.36,47.27) v1(21.36,44.27) v1(21.36,41.27) v1(21.36,35.27) v1(21.36,8.27) v1(21.36,5.27) v1(21.36,2.27) v1(22.99,26.28) v1(23.24,14.35) v1(23.24,11.17) v1(23.5,12.57) v1(24.23,41.27) v1(24.36,65.27) v1(24.36,62.27) v1(24.36,59.27) v1(24.36,56.27) v1(24.36,53.27) v1(24.36,50.27) v1(24.36,47.27) v1(24.36,44.27) v1(24.36,38.27) v1(24.36,8.27) v1(24.36,5.27) v1(24.36,2.27) v1(26.42,14.09) v1(26.65,20.13) v1(27.36,14.27) v1(27.36,8.27) v1(27.36,5.27) v1(27.36,2.27) v1(28.96,25.81) v1(29.08,20.06) v1(30.36,11.27) v1(30.36,8.27) v1(30.36,5.27) v1(30.36,2.27) v1(30.87,18.82) v1(33.1,25.81) v1(33.4,18.9) v1(33.36,8.27) v1(33.36,5.27) v1(33.36,2.27) v1(35.47,25.81) v1(36.36,17.27) v1(36.36,5.27) v1(36.36,2.27) v1(37.96,25.81) v1(39.36,8.27) v1(39.36,2.27) v1(40.03,11.13) v1(40.12,13.47) v1(40.29,9.59) v1(42.36,2.27) v1(42.55,25.78) v1(43.68,19.23) v1(43.74,17.8) v1(43.73,14.55) v1(43.99,10.82) v1(44.01,9.73) v1(44.3,12.65) v1(44.94,19) v1(45.36,2.27) v1(46.22,19.07) v1(46.28,12.72) v1(46.36,25.78) v1(46.5,9.79) v1(48.36,5.27) v1(48.36,2.27) v1(48.67,19.09) v1(48.98,11.07) v1(49.96,25.81) v1(51.36,2.27) v1(52.96,25.81) v1(53.25,11.34) v1(53.27,14.8) v1(53.33,9.7) v1(54.36,17.27) v1(54.36,2.27) v1(54.64,18.9) v1(54.83,13.47) v1(55.96,25.81) v1(57.36,2.27) v1(58.04,15.74) v1(58.96,25.81) v1(60.36,2.27) v1(60.49,14.27) v1(61.71,25.81) v1(63.36,2.27) v1(63.5,25.78) v1(64.19,14.69) v1(64.68,18.98) v1(65.21,25.81) v1(66.36,2.27) v1(67.51,19.12) v1(68.96,25.78) v1(69.36,2.27) v1(70.87,11.08) v1(71.04,16.41) v1(70.96,9.69) v1(71.4,14.81) v1(72.36,5.27) v1(72.36,2.27) v1(73.14,12.98) v1(73.22,19.02) v1(73.96,25.81) v1(75.36,5.27) v1(75.36,2.27) v1(76.58,25.81) v1(78.36,5.27) v1(78.36,2.27) v1(79.96,25.81) v1(80.99,19.12) v1(80.98,12.21) v1(81.14,15.54) v1(81.36,5.27) v1(81.36,2.27) v1(82.96,25.81) v1(83.92,11.66) v1(84.25,15.72) v1(84.36,5.27) v1(84.36,2.27) v1(84.51,19.16) v1(84.64,13.57) v1(85.96,25.81) v1(87.36,5.27) v1(87.36,2.27) v1(88.58,25.81) v1(88.71,13.47) v1(89.65,8.93) v1(90.36,17.27) v1(90.36,5.27) v1(90.36,2.27) v1(91.2,25.81) v1(93.23,25.81) v1(93.36,17.27) v1(93.36,5.27) v1(93.36,2.27) v1(95.46,18.97) v1(95.59,25.81) v1(96.36,14.27) v1(96.36,5.27) v1(96.36,2.27) v1(97.16,16.21) v1(97.76,19.01) v1(97.96,25.81) v1(99.36,14.27) v1(99.36,5.27) v1(99.36,2.27) v1(99.57,16.13) v1(100.2,9.02) v1(100.96,25.81) v1(101.38,19.1) v1(102.36,14.27) v1(102.36,5.27) v1(102.36,2.27) v1(103.85,11.96) v1(103.96,25.81) v1(105.36,17.27) v1(105.36,14.27) v1(105.36,2.27) v1(106.2,25.81) v1(107.39,12.87) v1(108.36,2.27) v1(108.56,25.81) v1(109.05,7.22) v1(110.22,12.18) v1(111.36,2.27) v1(112.96,25.81) v1(113.67,4.94) v1(114.43,19.17) v1(114.36,8.27) v1(114.36,2.27) v1(114.54,15.9) v1(115.83,19.17) v1(115.83,15.87) v1(115.78,12.87) v1(115.96,25.81) v1(116.89,10.13) v1(117.22,19.17) v1(117.22,15.74) v1(117.36,2.27) v1(117.48,3.68) v1(118.96,25.81) v1(119.1,21.22) v1(120.36,2.27) v1(121.67,25.78) v1(123.13,14.79) v1(123.32,13.54) v1(123.25,11.44) v1(123.36,17.27) v1(123.36,2.27) v1(124.33,25.78) v1(124.57,5.46) v1(126.31,25.81) v1(126.36,17.27) v1(126.36,2.27) v1(128.47,25.81) v1(129.36,17.27) v1(129.36,2.27) v1(131.21,25.81) v1(131.55,18.99) v1(132.36,2.27) v1(133.72,16.73) v1(133.96,25.81) v1(135.36,5.27) v1(135.36,2.27) v1(135.89,16.81) v1(136.96,25.81) v1(138.36,8.27) v1(138.36,5.27) v1(138.36,2.27) v1(138.65,18.69) v1(139.32,25.78) v1(141.36,11.27) v1(141.36,8.27) v1(141.36,5.27) v1(141.36,2.27) v1(142.96,25.81) v1(144.36,14.27) v1(144.36,11.27) v1(144.36,8.27) v1(144.36,5.27) v1(144.36,2.27) v1(145.96,25.81) v1(147.42,18.5) v1(147.36,14.27) v1(147.36,11.27) v1(147.36,8.27) v1(147.36,5.27) v1(147.36,2.27) v1(148.96,25.81) v1(150.36,14.27) v1(150.36,11.27) v1(150.36,8.27) v1(150.36,5.27) v1(150.36,2.27) v1(151.96,25.81)
$K1_5: length 28.7
  Top Layer w0.254: v1(92.2,18.16) 92.2,29.65 K1.5 ; U2.15 86.52,12.82 92.2,12.82 v1(96.78,17.39)
  Bottom Layer w0.254: v1(92.2,18.16) 96.01,18.16 v1(96.78,17.39)
$K1_6: length 25.5
  Top Layer w0.254: U2.16 91.48,14.13 94.62,17.27 94.62,22.2 96.92,24.51 99.31,24.51 99.89,25.08 K1.6
$K2_5: length 29.2
  Top Layer w0.254: v1(91.06,15.36) 86.52,15.36 86.47,15.4 ; K2.5 102.43,17.2 100.59,15.36 v1(96.14,15.36)
  Bottom Layer w0.254: v1(96.14,15.36) v1(91.06,15.36)
$K2_6: length 19.3
  Top Layer w0.254: 113.56,19.91 110.45,19.91 110.05,20.31 K2.6 ; 113.56,19.91 113.59,19.91 ; 113.56,19.91 113.79,19.68 113.79,15.74 113.45,15.4 112.01,15.4
$K3_5: length 19
  Top Layer w0.254: K3.5 115.19,27.11 115.19,15.49 113.84,14.13 U1.5
$K3_6: length 21.5
  Top Layer w0.254: K3.6 120.21,25.2 116.46,21.46 116.46,15.11 114.22,12.86 U1.6
$K4_5: length 25.3
  Top Layer w0.254: U1.7 116.65,11.59 117.98,12.93 117.98,21.08 122.75,25.84 K4.5
$K4_6: length 28.4
  Top Layer w0.254: U1.14 119.97,11.59 119,12.57 119,19.55 123.44,24 129.67,24 130.43,24.76 130.43,29.65 K4.6
$K5_5: length 25.4
  Top Layer w0.254: K5.5 132.91,16.95 130.09,14.13 U1.16
$K5_6: length 30.2
  Top Layer w0.254: U1.15 130.85,12.86 140.53,22.54 K5.6
$K6_5: length 85.2
  Top Layer w0.254: v1(112.4,4.31) 126.37,4.31 143.38,21.33 143.38,25.4 143.54,25.56 143.54,26.05 143.38,26.21 143.38,29.39 K6.5 ; U2.7 82.34,11.59 82.95,10.98 102.19,10.98 v1(103.14,10.03)
  Bottom Layer w0.254: v1(103.14,10.03) 106.83,6.34 110.62,6.34 112.4,4.57 v1(112.4,4.31)
$K6_6: length 86.2
  Top Layer w0.254: v1(107.44,7.11) 107.44,6.85 111.33,2.97 129.46,2.97 143.38,16.89 149.61,16.89 150.69,17.97 K6.6 ; U2.14 88.76,11.59 89.18,12.02 102.53,12.02 v1(104.14,10.41)
  Bottom Layer w0.254: v1(107.44,7.11) v1(104.14,10.41)
$K7_5: length 29
  Top Layer w0.254: U3.16 57.7,14.13 v1(64.52,20.95) ; K7.5 60.14,21.14 v1(60.07,21.08)
  Bottom Layer w0.254: v1(60.07,21.08) 60.2,20.95 v1(64.52,20.95)
$K7_6: length 24.1
  Top Layer w0.254: 51.47,15.4 56.69,15.4 67.76,26.47 K7.6
$K8_5: length 21.7
  Top Layer w0.254: U3.14 49.62,11.59 47.75,13.46 47.75,25.39 49.98,27.62 K8.5
$K8_6: length 25
  Top Layer w0.254: U3.15 50.25,12.86 49.53,13.58 49.53,23.36 50.29,24.12 55.88,24.12 57.6,25.84 K8.6
$K9_5: length 20.5
  Top Layer w0.254: K9.5 39.82,26.86 44.32,22.35 44.32,13.71 43.48,12.86 U3.6
$K9_6: length 21.7
  Top Layer w0.254: K9.6 45.52,27.8 45.52,12.88 44.24,11.59 U3.7
$K10_5: length 24.9
  Top Layer w0.254: K10.5 29.66,21.01 v1(30.23,20.44) ; 42.01,15.4 36.92,15.4 34.4,17.92 v1(34.4,20.44)
  Bottom Layer w0.254: v1(34.4,20.44) v1(30.23,20.44)
$K10_6: length 25.3
  Top Layer w0.254: U3.5 36.15,14.13 32.05,18.23 32.05,20.61 37.28,25.84 K10.6
$K11_5: length 24.5
  Top Layer w0.254: K11.5 70.3,25.08 70.87,24.51 75.82,24.51 78.49,21.84 78.49,18.28 79.5,17.27 79.5,14.73 78.78,14.01 77.14,14.01 U2.5
$K11_6: length 24.9
  Top Layer w0.254: 77.01,15.4 75.57,15.4 75.31,15.15 75.31,13.84 75.69,13.46 79.38,13.46 80.27,14.35 80.27,23.13 77.92,25.48 K11.6
$U1_18: length 49.4
  Top Layer w0.254: U2.3 78.19,16.67 78.61,16.25 v1(78.61,14.85) ; v1(93.47,12.82) NOREF#7.TP6 105.92,12.82 v1(108.59,15.49) ; U1.18 v1(119.76,16.67)
  Bottom Layer w0.254: v1(108.59,15.49) 109.77,16.67 v1(119.76,16.67) ; v1(93.47,12.82) 79.12,12.82 78.61,13.33 v1(78.61,14.85)
$U2_18: length 47.6
  Top Layer w0.254: v1(72.39,15.49) NOREF#3.TP7 63.63,15.49 60.96,12.82 v1(53.72,12.82) ; 42.01,16.67 v1(43.67,16.67) ; U2.18 v1(81.32,16.67)
  Bottom Layer w0.254: v1(81.32,16.67) 75.48,16.67 74.3,15.49 v1(72.39,15.49) ; v1(53.72,12.82) 47.52,12.82 v1(43.67,16.67)
CLK: length 173.4
  Top Layer w0.254: v1(81.89,10.3) 86.45,10.3 U2.13 89.24,10.32 89.79,9.77 v1(101.6,9.77) ; U1.13 123.15,10.32 124.08,9.39 124.08,7.23 122.37,5.52 110.18,5.52 v1(110.11,5.46) ; v1(72.95,11.81) 71.46,10.32 U3.13 48.94,10.32 v1(47.25,8.63) ; v1(47.25,5.46) 46.86,5.07 37.72,5.07 35.69,7.11 NOREF#6.TP1 17.78,7.11 15.66,9.23 8.42,9.23 3.43,14.22 3.43,45.46 3.75,45.78 7.84,45.78
  Bottom Layer w0.254: v1(47.25,5.46) v1(47.25,8.63) ; v1(110.11,5.46) 106.43,5.46 102.11,9.77 v1(101.6,9.77) ; v1(81.89,10.3) 80.38,11.81 v1(72.95,11.81)
CT: length 1.9
  Top Layer w0.254: C6.1 21.96,13.59 U4.4
DATA: length 164.4
  Top Layer w0.254: U1.3 111.97,16.63 110.67,16.63 109.35,15.31 109.35,10.03 103.12,3.8 NOREF#5.TP5 19,3.8 15.57,7.23 8.51,7.23 2.16,13.58 2.16,49.4 3.62,50.86 7.84,50.86
HI-1: length 26.2
  Top Layer w0.6: K10.3 30.86,34.79 31.75,35.68 31.75,45.08 31.01,45.82 31.01,59.15
HI-2: length 26.2
  Top Layer w0.6: CN2.3 41.17,45.82 41.91,45.08 41.91,35.68 41.02,34.79 39.82,34.79
HI-3: length 26.2
  Top Layer w0.6: CN2.5 51.33,45.82 52.07,45.08 52.07,35.68 51.18,34.79 49.98,34.79
HI-4: length 26.2
  Top Layer w0.6: 60.14,34.79 61.34,34.79 62.23,35.68 62.23,45.08 61.49,45.82 CN2.7
HI-5: length 26.2
  Top Layer w0.6: 70.3,34.79 71.5,34.79 72.39,35.68 72.39,45.08 71.65,45.82 CN2.9
HI-6: length 26.2
  Top Layer w0.6: CN3.1 93.61,45.82 94.35,45.08 94.35,35.68 93.46,34.79 92.25,34.79
HI-7: length 26.2
  Top Layer w0.6: CN3.3 103.77,45.82 104.51,45.08 104.51,35.68 103.62,34.79 102.41,34.79
HI-8: length 26.2
  Top Layer w0.6: CN3.5 113.93,45.82 114.67,45.08 114.67,35.68 113.78,34.79 112.57,34.79
HI-9: length 26.2
  Top Layer w0.6: CN3.7 124.09,45.82 124.83,45.08 124.83,35.68 123.94,34.79 122.73,34.79
HI-10: length 26.2
  Top Layer w0.6: 132.89,34.79 134.1,34.79 134.99,35.68 134.99,45.08 134.25,45.82 CN3.9
HI-A: length 162.8
  Top Layer w0.6: K11.4 70.55,32.25 71.82,33.52 80.01,33.52 81.81,35.32 CN2.11
  Bottom Layer w0.5: K6.2 145.03,37.33 145.67,37.97 145.67,42.41 136.65,51.43 83.95,51.43 81.81,53.57 CN2.11
  Bottom Layer w0.6: K11.4 69.03,33.52 61.41,33.52 K7.4 58.87,33.52 51.25,33.52 K8.4 48.71,33.52 42.04,33.52 40.77,32.25 K9.4 38.55,33.52 30.93,33.52 K10.4
HI-B: length 28.7
  Top Layer w0.6: K6.4 144.14,32.25 145.15,33.26 145.15,45.08 144.41,45.82 CN3.11
HI_A/B_R: length 56.1
  Bottom Layer w0.6: K6.3 141.8,33.52 134.18,33.52 K5.4 131.64,33.52 124.02,33.52 K4.4 121.48,33.52 113.86,33.52 K3.4 111.32,33.52 103.7,33.52 K2.4 101.16,33.52 93.54,33.52 K1.4
ID: length 2.2
  Top Layer w0.254: CN1.20 10.16,22.92 U5.2
LO-1: length 26.3
  Top Layer w0.6: 36.09,59.15 36.09,45.99 35.18,45.08 35.18,35.68 36.07,34.79 K10.8
LO-2: length 26.3
  Top Layer w0.6: CN2.4 46.25,45.99 45.34,45.08 45.34,35.68 46.23,34.79 47.44,34.79
LO-3: length 26.3
  Top Layer w0.6: 57.6,34.79 56.39,34.79 55.5,35.68 55.5,45.08 56.41,45.99 CN2.6
LO-4: length 26.3
  Top Layer w0.6: 67.76,34.79 66.55,34.79 65.66,35.68 65.66,45.08 66.57,45.99 CN2.8
LO-5: length 26.3
  Top Layer w0.6: 77.92,34.79 76.71,34.79 75.82,35.68 75.82,45.08 76.73,45.99 CN2.10
LO-6: length 26.3
  Top Layer w0.6: CN3.2 98.69,45.99 97.77,45.08 97.77,35.68 98.66,34.79 99.87,34.79
LO-7: length 26.3
  Top Layer w0.6: 110.03,34.79 108.82,34.79 107.93,35.68 107.93,45.08 108.85,45.99 CN3.4
LO-8: length 26.3
  Top Layer w0.6: CN3.6 119.01,45.99 118.09,45.08 118.09,35.68 118.98,34.79 120.19,34.79
LO-9: length 26.3
  Top Layer w0.6: 130.35,34.79 129.14,34.79 128.25,35.68 128.25,45.08 129.17,45.99 CN3.8
LO-10: length 26.3
  Top Layer w0.6: 140.51,34.79 139.3,34.79 138.41,35.68 138.41,45.08 139.33,45.99 CN3.10
LO-A: length 158
  Top Layer w0.6: K11.7 84.33,32.25 87,34.92 87,59.05 CN2.12
  Bottom Layer w0.5: K6.9 148.59,37.33 148.08,37.84 148.08,43.56 138.18,53.46 88.27,53.46 86.89,54.84 CN2.12
  Bottom Layer w0.6: K10.7 38.55,30.98 46.17,30.98 K9.7 48.71,30.98 56.33,30.98 K8.7 58.87,30.98 66.49,30.98 K7.7 69.03,30.98 76.65,30.98 K11.7
LO-B: length 28.8
  Top Layer w0.6: CN3.12 149.49,45.99 148.57,45.08 148.57,33.28 149.61,32.25 K6.7
LO_A/B_R: length 57.1
  Bottom Layer w0.6: K6.8 149.23,34.79 145.42,30.98 141.8,30.98 K5.7 139.26,30.98 131.64,30.98 K4.7 129.1,30.98 121.92,30.98 120.65,32.25 K3.7 118.94,30.98 111.32,30.98 K2.7 108.78,30.98 101.16,30.98 K1.7
NRST: length 38.2
  Top Layer w0.254: 24.63,13.56 24.63,17.12 22.99,18.76 22.99,24.12 20.45,26.66 20.45,34.41 19.24,35.62 NOREF#2.TP1 CN1.25 5.3,35.62
OE/RST_OUT: length 100.7
  Top Layer w0.254: v1(109.47,9.01) 111.97,9.01 U1.9 U1.8 ; v1(32.89,15.23) 32.95,15.23 37.87,10.32 U3.8 U3.9 46,9.05 49.09,5.96 70.61,5.96 74.97,10.32 U2.8 U2.9 80.22,9.05 82.81,6.47 104.01,6.47 v1(106.55,9.01) ; NOREF.TP4 v1(28.32,11.68) 28.31,11.66 R4.1 24.63,11.66
  Bottom Layer w0.254: v1(32.89,15.23) 29.34,11.68 v1(28.32,11.68) ; v1(106.55,9.01) v1(109.47,9.01)
SENSE: length 3.9
  Top Layer w0.254: R2.1 19.69,11.48 R3.2 19.73,12.95 20.45,12.95 20.78,12.61 U4.5
STROBE: length 145.3
  Top Layer w0.254: v1(109.98,9.9) 109.98,10.28 110.62,10.92 113.67,10.92 115.53,9.05 U1.12 ; 5.3,40.7 9.74,40.7 9.76,40.68 19.13,40.68 24,35.81 24,21.39 39.18,6.22 v1(47.88,6.22) ; v1(47.88,8.12) 48.81,9.05 U3.12 71.54,9.05 73.44,10.95 79.94,10.95 81.84,9.05 U2.12 88.35,9.05 89.28,8.12 103.25,8.12 105.03,9.9 v1(107.82,9.9)
  Bottom Layer w0.254: v1(47.88,6.22) v1(47.88,8.12) ; v1(107.82,9.9) v1(109.98,9.9)

## Copper pours and planes (outline as drawn; the poured copper is in the pictures)
+5V on Top Layer: 4.16,34.36 4.17,34.46 4.22,34.6 4.3,34.71 4.42,34.8 4.55,34.85 4.66,34.86 19.37,34.86 19.48,34.85 19.61,34.8 19.73,34.71 19.81,34.6 19.86,34.46 19.87,34.36 19.87,24.88 19.86,24.77 19.81,24.64 19.73,24.52 19.61,24.44 19.48,24.39 19.37,24.38 4.66,24.38 4.55,24.39 4.42,24.44 4.3,24.52 4.22,24.64 4.17,24.77 4.16,24.88
GND on Top Layer: -0.12,68.61 24.67,68.61 24.67,-0.98 -0.12,-0.98
GND on Top Layer: 0.13,26.19 152.4,26.19 152.4,-7.08 0.13,-7.08
GND on Bottom Layer: 0,25.66 0.01,25.76 0.06,25.9 0.15,26.01 0.26,26.1 0.39,26.15 0.5,26.16 151.9,26.16 152.01,26.15 152.14,26.1 152.25,26.01 152.34,25.9 152.39,25.76 152.4,25.66 152.4,0.32 152.39,0.21 152.34,0.08 152.25,-0.04 152.14,-0.12 152.01,-0.17 151.9,-0.18 0.5,-0.18 0.39,-0.17 0.26,-0.12 0.15,-0.04 0.06,0.08 0.01,0.21 0,0.32
GND on Bottom Layer: -0.25,67.9 -0.24,68.01 -0.19,68.14 -0.11,68.26 0.01,68.34 0.14,68.39 0.25,68.4 24.14,68.4 24.24,68.39 24.37,68.34 24.49,68.26 24.57,68.14 24.62,68.01 24.64,67.9 24.64,-0.52 24.62,-0.63 24.57,-0.76 24.49,-0.88 24.37,-0.96 24.24,-1.01 24.14,-1.02 0.25,-1.02 0.14,-1.01 0.01,-0.96 -0.11,-0.88 -0.19,-0.76 -0.24,-0.63 -0.25,-0.52
$C10_2 on Top Layer: 13.23,23.63 13.24,23.73 13.29,23.87 13.38,23.98 13.49,24.07 13.62,24.12 13.73,24.13 20.7,24.13 20.81,24.12 20.94,24.07 21.06,23.98 21.14,23.87 21.19,23.73 21.2,23.63 21.2,20.35 21.19,20.24 21.14,20.11 21.06,19.99 20.94,19.91 20.81,19.86 20.7,19.85 13.73,19.85 13.62,19.86 13.49,19.91 13.38,19.99 13.29,20.11 13.24,20.24 13.23,20.35

Small or netless copper shapes (teardrops, artwork), in the pictures only: 229 on Top Layer, 121 on Bottom Layer

## Text on the board
Bottom Silkscreen Layer: Designed by: / Arwid Vasilev / github.com/arwidcool / PCB Outline By: / Patrick Baus
Top Silkscreen Layer: ID | GND | NRST | 5V | DATA | CLK | OE/RST | STROBE | V1.0 | Replacement | WARNING!!! | H | CH1 | L | CH2 | CH3 | CH4 | CH5 | OUT A | CH6 | CH7 | CH8 | CH9 | CH10 | OUT B | MAX 200VDC / 125VAC / 1A / VOLTAGE & RESISTANCE ONLY / 220V TO EARTH MAXIMUM
